# EAGLE design MySens-GWeasyRS485-Nano-005 (EAGLE 7.3.0)
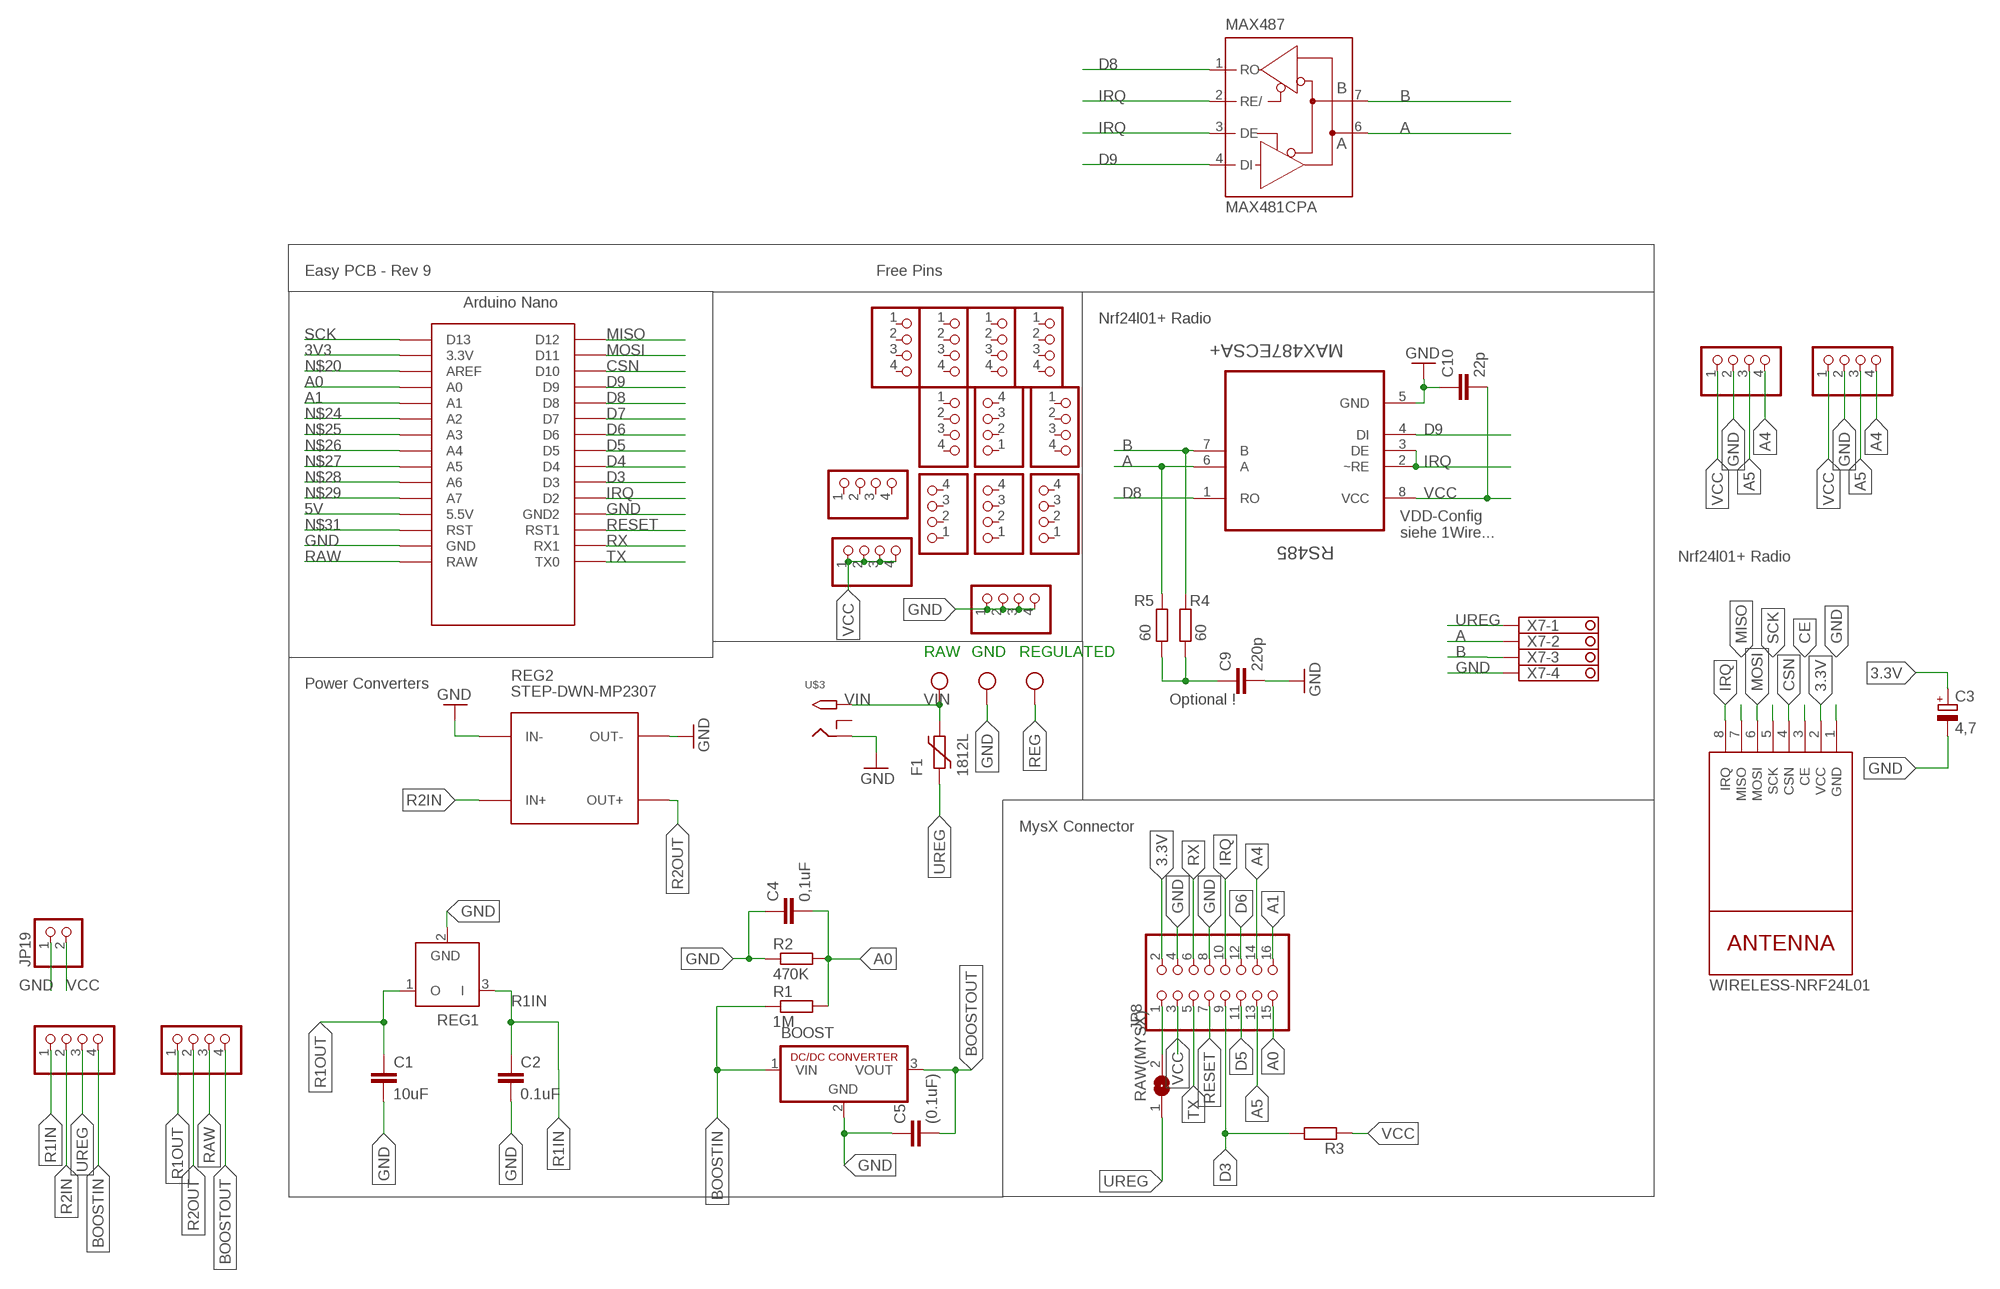
[diagram p0: schematic, sheet 1]

## Parts
BOOST  R-78C1.8-1.0  [SIP3]
C1  10uF  C-EUC1210  [C1210]
C2  0.1uF  C-EUC1206  [C1206]
C3  4,7  CPOL-EUSMCC  [SMC_C]
C4  0,1uF  C-EUC1206  [C1206]
C5  (0.1uF)  C-EUC1206  [C1206]
C9  220p  C-EUC0805  [C0805]
C10  22p  C-EUC0805  [C0805]
F1  1812L  [1812L]
JP1  PINHD-1X04_2.54-S  [1X04-S]
JP2  PINHD-1X04_2.54-S  [1X04-S]
JP3  PINHD-1X04_2.54-S  [1X04-S]
JP4  PINHD-1X04_2.54-S  [1X04-S]
JP5  PINHD-1X04_2.54-S  [1X04-S]
JP6  PINHD-1X04_2.54-S  [1X04-S]
JP7  PINHD-1X04_2.54-S  [1X04-S]
JP8  PINHD-2X08_2.54  [2X08]
JP9  PINHD-1X04_2.54-S  [1X04-S]
JP10  PINHD-1X04_2.54-S  [1X04-S]
JP11  PINHD-1X04_2.54-S  [1X04-S]
JP12  PINHD-1X04_2.54-S  [1X04-S]
JP13  PINHD-1X04_2.54-S  [1X04-S]
JP14  PINHD-1X04_2.54-S  [1X04-S]
JP15  PINHD-1X04_2.54-S  [1X04-S]
JP16  PINHD-1X04_2.54-S  [1X04-S]
JP17  PINHD-1X04_2.54-S  [1X04-S]
JP18  PINHD-1X04_2.54-S  [1X04-S]
JP19  PINHD-1X2  [1X02]
MAX487  MAX481CPA  [DIL08]
NRF24L01+  WIRELESS-NRF24L01  [WIRELESS-NRF24L01]
R1  1M  R-EU_R0805  [R0805]
R2  470K  R-EU_R0805  [R0805]
R3  R-EU_R0805  [R0805]
R4  60  R-EU_R0805  [R0805]
R5  60  R-EU_R0805  [R0805]
RAW(MYSX)  SJ  [SJ]
REG1  LP2950Z  [TO92]
REG2  STEP-DWN-MP2307  DC-DC-STEP-DOWN-MP2307  [DC-DC-STEP-DOWN-MP2307]
REGULATED  W237-103  [W237-103]
RS485  MAX487ECSA+  [SOIC127P600X175-8N]
U$2  NANO  [NANO]
U$3  2.1MMJACKTHM  [PJ-102A]
X7  1751264  [1751264]

## Nets
3.3V [Power]: C3.+ JP8.2 NRF24L01+.2(VCC)
3V3: U$2.3.3V
5V: U$2.5V(5.5V)
A: MAX487.6(A) R5.2 RS485.6(A) X7.2
A0: C4.2 JP8.15 R1.2 R2.2 U$2.A0
A1: JP8.16 U$2.A1
A4: JP6.4 JP8.14 JP10.4
A5: JP6.3 JP8.13 JP10.3
B: MAX487.7(B) R4.2 RS485.7(B) X7.3
BOOSTIN [Power]: BOOST.1(VIN) JP2.4 R1.1
BOOSTOUT [Power]: BOOST.3(VOUT) C5.2 JP4.4
CE: NRF24L01+.3(CE)
CSN: NRF24L01+.4(CSN) U$2.D10
D3: JP8.9 R3.2 U$2.D3
D4: U$2.D4
D5: JP8.11 U$2.D5
D6: JP8.12 U$2.D6
D7: U$2.D7
D8: MAX487.1(RO) RS485.1(RO) U$2.D8
D9: MAX487.4(DI) RS485.4(DI) U$2.D9
GND [Power]: BOOST.2(GND) C1.2 C2.2 C3.- C4.1 C5.1 C9.2 C10.1 JP1.1 JP1.2 JP1.3 JP1.4 JP6.2 JP8.4 JP8.8 JP10.2 JP19.1 NRF24L01+.1(GND) R2.1 REG1.2(GND) REG2.IN- REG2.OUT- REGULATED.2 RS485.5(GND) U$2.GND U$2.GND1(GND2) U$3.RING X7.4
IRQ: JP8.10 MAX487.2(RE/) MAX487.3(DE) NRF24L01+.8(IRQ) RS485.2(~RE) RS485.3(DE) U$2.D2
MISO: NRF24L01+.7(MISO) U$2.D12
MOSI: NRF24L01+.6(MOSI) U$2.D11
N$1: JP8.1 RAW(MYSX).2
N$20: U$2.AREF
N$21: C9.1 R4.1 R5.1
N$24: U$2.A2
N$25: U$2.A3
N$26: U$2.A4
N$27: U$2.A5
N$28: U$2.A6
N$29: U$2.A7
N$31: U$2.RST
R1IN [Power]: C2.1 JP2.1 REG1.3(I)
R1OUT [Power]: C1.1 JP4.1 REG1.1(O)
R2IN [Power]: JP2.2 REG2.IN+
R2OUT [Power]: JP4.2 REG2.OUT+
RAW [Power]: JP4.3 U$2.RAW
REG [Power]: REGULATED.1
RESET: JP8.7 U$2.RST1
RX: JP8.6 U$2.RX1
SCK: NRF24L01+.5(SCK) U$2.D13
TX: JP8.5 U$2.TX0
UREG [Power]: F1.P$1 JP2.3 RAW(MYSX).1 X7.1
VCC [Power]: C10.2 JP3.1 JP3.2 JP3.3 JP3.4 JP6.1 JP8.3 JP10.1 JP19.2 R3.1 RS485.8(VCC)
VIN [Power]: F1.P$2 REGULATED.3 U$3.TIP
Unconnected: JP5.1 JP5.2 JP5.3 JP5.4 JP7.1 JP7.2 JP7.3 JP7.4 JP9.1 JP9.2 JP9.3 JP9.4 JP11.1 JP11.2 JP11.3 JP11.4 JP12.1 JP12.2 JP12.3 JP12.4 JP13.1 JP13.2 JP13.3 JP13.4 JP14.1 JP14.2 JP14.3 JP14.4 JP15.1 JP15.2 JP15.3 JP15.4 JP16.1 JP16.2 JP16.3 JP16.4 JP17.1 JP17.2 JP17.3 JP17.4 JP18.1 JP18.2 JP18.3 JP18.4 U$2.ICSP1 U$2.ICSP2 U$2.ICSP3 U$2.ICSP4 U$2.ICSP5 U$2.ICSP6 U$3.RING_SW

## Notes on the sheet
- Easy PCB - Rev 9 | Free Pins
- Nrf24l01+ Radio
- VDD-Config
  siehe 1Wire...
- Nrf24l01+ Radio
- RAW | GND | REGULATED
- Power Converters
- Optional !
- MysX Connector

## Power pins joined to a net without a drawn wire
GND: MAX487.5(GND)
VCC: MAX487.8(VCC)

## Library data of the parts
BOOST = dc-dc-converter:R-78C*-1.0: INNOLINE DC/DC-Converter 1.0 AMP SIP3 Single Output Source: Data sheet <http://www.mikrocontroller.net/attachment/150645/157764-da-01-en-DC_DC_WANDLER_R_78C5_0_1_0.pdf>
C1 C2 C4 C5 C9 C10 = rcl:C-EU: CAPACITOR, European symbol
C3 = rcl:CPOL-EU: POLARIZED CAPACITOR, European symbol
F1 = ptc-littlefuse:1812L
JP1-JP7 JP9-JP18 = pinhead-2:PINHD-1X04: PIN HEADER
JP8 = pinhead-2:PINHD-2X08: PIN HEADER
JP19 = pinhead:PINHD-1X2: PIN HEADER
MAX487 = maxim-4:MAX481CPA: RS485 TRANSEIVER
NRF24L01+ = diy-modules:WIRELESS-NRF24L01: 2.4 GHz Wireless Module based on NRF24L01 chip
R1-R5 = rcl:R-EU_: RESISTOR, European symbol
RAW(MYSX) = jumper:SJ: SMD solder JUMPER
REG1 = linear:LP2950: 100 mA, Low Power Low Dropout Voltage Regulator Source: http://www.onsemi.com/pub/Collateral/LP2950-D.PDF
REG2 = diy-modules:DC-DC-STEP-DOWN-MP2307: DC/DC Step-Down Regulator based on MP2307DN chip MP2307 datasheet available here: https://cdn-shop.adafruit.com/datasheets/MP2307_r1.9.pdf Click here to find device on ebay.com <http://www.ebay.com/sch/dc+dc+3a+mini+converter>
REGULATED = con-wago-500:W237-103: WAGO SCREW CLAMP; MPN: 237-103; OC_FARNELL: unknown; OC_NEWARK: 18M7116
RS485 = Maxim_By_element14_Batch_1:MAX487ECSA+: Low-Power, Slew-Rate-Limited RS-485/RS-422 Transceivers; MPN: MAX487ECSA+; OC_FARNELL: 9724532; OC_NEWARK: 68K4803; PACKAGE: SOIC-8; SUPPLIER: Maxim
U$2 = Arduino-clone:NANO: Arduino Nano
U$3 = adafruit:2.1MMJACK: 2.1mm x 5.5mm THM DC jack with internal switch. Digikey part #PJ-102A, 4UCON part #05537 2.1mm x 5.5mm SMT DC jack with internal switch. Digikey part #PJ-002A-SMT, 4UCON part #03267 By microbuilder.eu & adafruit.com
X7 = con-phoenix-350:1751264: MKDS 1/ 4-3,5 Printklemme Nennstrom: 10 A Bemessungsspannung: 160 V Raster: 3,5 mm Polzahl: 4 Montageart: Löten Anschlussart: Schraubanschluss Anschlussrichtung vom Leiter zur Platine: 0° Source: http://eshop.phoenixcontact.com .. 1751264.pdf; MPN: 1751264; OC_FARNELL: unknown; OC_NEWARK: 10R0934

## Net classes
0 default: width 0.305 mm
1 Power: width 0.508 mm

## Board
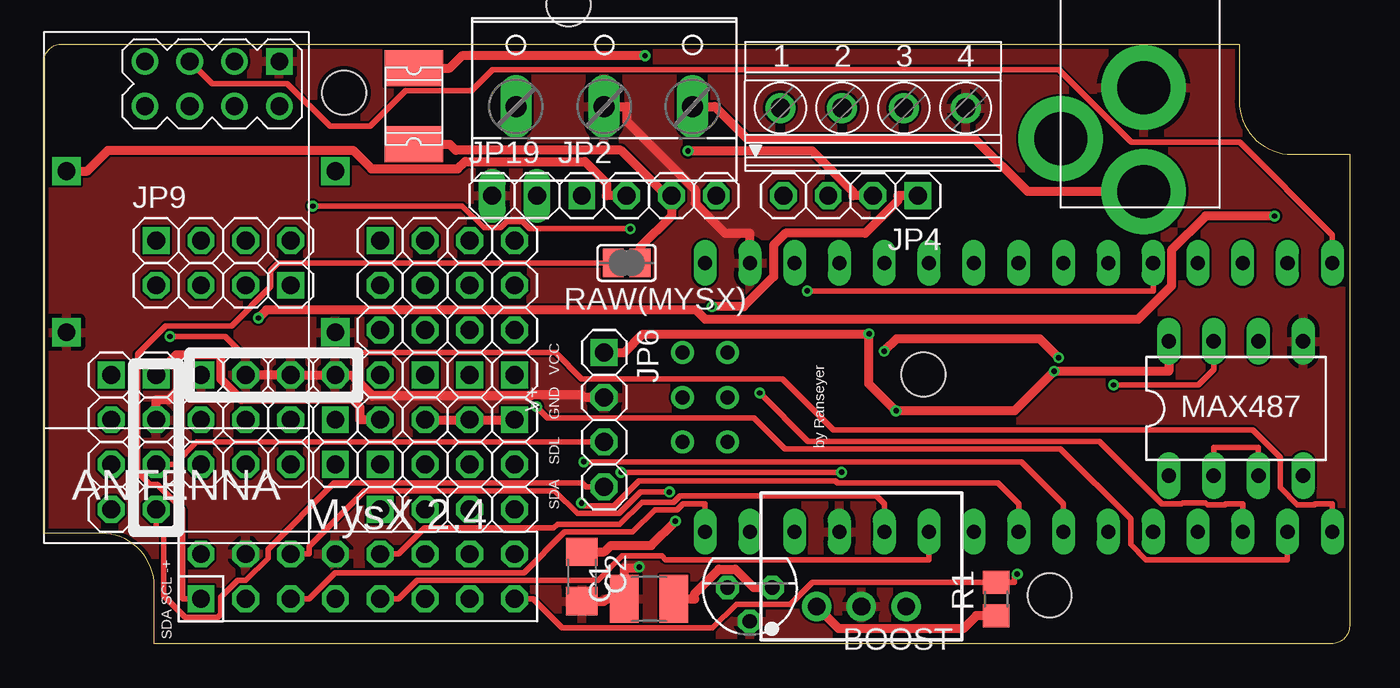
[diagram p1: board, top side]
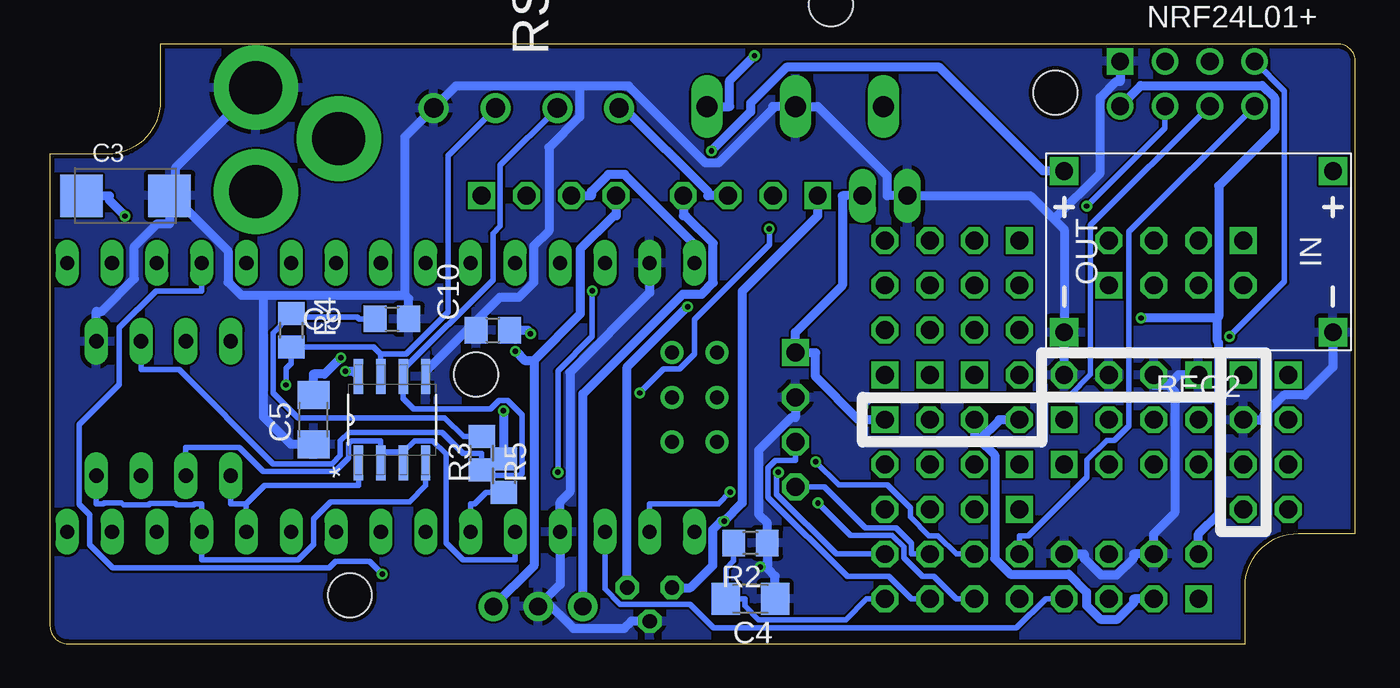
[diagram p2: board, bottom side, seen from below]

Size 74 x 34 mm. Coordinates in mm from the lower left corner, seen from the top.
Outline: 0,6.25 0,33 arc-90 1,34 67.75,34 67.75,30.75 arc90 70.75,27.75 74,27.75 74,1 arc-90 73,0 6.25,0 6.25,3.25 arc90 3.25,6.25 0,6.25
Copper layers (1*16): Top 0.035mm / dielectric 1.5mm / Bottom 0.035mm
Design rules "dirt_cheap_dirty_boards.v1": minimum track width 5mil, minimum drill 12mil, track to track 5mil, track to pad 5mil, pad to pad 5mil, via to via 5mil, smd to smd 0mil, copper to edge 10mil, drill to drill 10mil, minimum pad ring 10mil, minimum via ring 6mil, stop-mask expansion 2mil, vias tented up to drill 25mil, thermal gap 10mil
Holes 2.5 mm at 29.72,36.25 49.85,15.27 57,2.75 17,31.25

### Footprints (pad centres in the part's own frame; a part is rotated, then mirrored left to right if it is on the bottom)
SIP3 = drill 1 pad 1.676: 1 -2.54,0; 2 0,0; 3 2.54,0
C1210 = smd 1.6 x 2.7: 1 -1.4,0; 2 1.4,0
C1206 = smd 1.6 x 1.8: 1 -1.4,0; 2 1.4,0
SMC_C = smd 2.4 x 2.4: + -2.5,0; - 2.5,0
C0805 = smd 1.3 x 1.5: 1 -0.95,0; 2 0.95,0
1812L = smd 2.03 x 3.3: P$1 -2.16,0; P$2 2.16,0
1X04-S = drill 1.016 square: 1 -3.81,0 | drill 1.016 octagon: 2 -1.27,0; 3 1.27,0; 4 3.81,0
2X08 = drill 1.016 square: 1 -8.89,-1.27 | drill 1.016 octagon: 2 -8.89,1.27; 3 -6.35,-1.27; 4 -6.35,1.27; 5 -3.81,-1.27; 6 -3.81,1.27; 7 -1.27,-1.27; 8 -1.27,1.27; 9 1.27,-1.27; 10 1.27,1.27; 11 3.81,-1.27; 12 3.81,1.27; 13 6.35,-1.27; 14 6.35,1.27; 15 8.89,-1.27; 16 8.89,1.27
1X02 = drill 1.016 long: 1 -1.27,0; 2 1.27,0
DIL08 = drill 0.813 long: 1 -3.81,-3.81; 2 -1.27,-3.81; 3 1.27,-3.81; 4 3.81,-3.81; 5 3.81,3.81; 6 1.27,3.81; 7 -1.27,3.81; 8 -3.81,3.81
WIRELESS-NRF24L01 = drill 1 square: 1 -12.7,6.35 | drill 1: 2 -10.16,6.35; 3 -12.7,3.81; 4 -10.16,3.81; 5 -12.7,1.27; 6 -10.16,1.27; 7 -12.7,-1.27; 8 -10.16,-1.27
R0805 = smd 1.3 x 1.5: 1 -0.95,0; 2 0.95,0
SJ = smd 1.168 x 1.6: 1 -0.762,0; 2 0.762,0
TO92 = drill 0.813 octagon: 1 -1.27,0; 2 0,1.905; 3 1.27,0
DC-DC-STEP-DOWN-MP2307 = drill 1 pad 1.6 square: IN+ -7.62,-4.572; IN- -7.62,4.572; OUT+ 7.62,-4.572; OUT- 7.62,4.572
W237-103 = drill 1.194 long: 1 -5,-1.29; 2 0,-1.29; 3 5,-1.29
SOIC127P600X175-8N = smd 1.981 x 0.533: 1 -2.464,1.905; 2 -2.464,0.635; 3 -2.464,-0.635; 4 -2.464,-1.905; 5 2.464,-1.905; 6 2.464,-0.635; 7 2.464,0.635; 8 2.464,1.905
NANO = drill 0.8 long: 3.3V -10.16,24.13; 5V -10.16,-1.27; A0 -10.16,19.05; A1 -10.16,16.51; A2 -10.16,13.97; A3 -10.16,11.43; A4 -10.16,8.89; A5 -10.16,6.35; A6 -10.16,3.81; A7 -10.16,1.27; AREF -10.16,21.59; D2 5.08,1.27; D3 5.08,3.81; D4 5.08,6.35; D5 5.08,8.89; D6 5.08,11.43; D7 5.08,13.97; D8 5.08,16.51; D9 5.08,19.05; D10 5.08,21.59; D11 5.08,24.13; D12 5.08,26.67; D13 -10.16,26.67; GND -10.16,-6.35; GND1 5.08,-1.27; RAW -10.16,-8.89; RST -10.16,-3.81; RST1 5.08,-3.81; RX1 5.08,-6.35; TX0 5.08,-8.89 | drill 0.8: ICSP1 -5.08,-10.16; ICSP2 -5.08,-7.62; ICSP3 -2.54,-10.16; ICSP4 -2.54,-7.62; ICSP5 0,-10.16; ICSP6 0,-7.62
PJ-102A = drill 3 pad 4.8: RING 0.1,-3.39; RING_SW -4.6,-6.29; TIP 0.1,-9.29
1751264 = drill 1.1 pad 1.7: 1 -5.25,-0.1; 2 -1.75,-0.1; 3 1.75,-0.1; 4 5.25,-0.1

### Placement (x,y rotation side)
BOOST  46.33,2.11 0 top
C1  34.29,2.54 180 top
C2  30.48,3.81 270 top
C3  69.72,25.4 0 bottom
C4  34.29,2.54 180 bottom
C5  59.05,12.7 90 bottom
C9  54.61,18.41 0 bottom
C10  48.9,17.78 0 bottom
F1  20.95,30.48 90 top
JP1  12.7,15.24 0 top
JP2  34.29,25.4 0 top
JP3  22.86,12.7 180 top
JP4  45.72,25.4 180 top
JP5  12.7,10.16 180 top
JP6  31.75,12.7 270 top
JP7  24.13,19.05 90 top
JP8  17.78,3.81 0 top
JP9  10.16,22.86 0 top
JP10  6.35,11.43 270 top
JP11  10.16,20.32 180 top
JP12  12.7,12.7 180 top
JP13  26.67,19.05 90 top
JP14  19.05,19.05 270 top
JP15  22.86,10.16 0 top
JP16  3.81,11.43 270 top
JP17  21.59,19.05 90 top
JP18  22.86,7.62 0 top
JP19  26.67,25.4 0 top
MAX487  67.56,13.34 0 top
NRF24L01+  6.99,20.32 270 top
R1  53.98,2.54 90 top
R2  34.29,5.71 180 bottom
R3  48.26,9.53 270 bottom
R4  60.33,17.78 270 bottom
R5  49.53,10.79 270 bottom
RAW(MYSX)  33.02,21.59 180 top
REG1  40.01,3.17 180 top
REG2  8.89,22.23 180 bottom
REGULATED  31.75,31.75 0 top
RS485  54.61,12.7 90 bottom
U$2  46.35,11.43 270 top
U$3  62.23,34.92 0 top
X7  46.99,30.48 0 top

### Tracks (layer width: path | path; a pad name or v marks a point on that pad's centre or on a via)
3.3V  (via drill 0.3 pad 0.61)
  Top 0.508: v69.75,24.25 65.84,24.25 63.91,22.31 63.91,20.29 62.01,18.39 37.48,18.39 36.95,18.93 12.61,18.93 v12.15,18.47
  Bottom 0.508: 7.82,18.47 v12.15,18.47 | NRF24L01+.2 12.16,31.65 5.28,31.65 4.58,30.95 4.58,29.11 7.75,25.95 7.75,18.54 7.82,18.47 | 7.82,18.47 7.82,17.14 7.75,17.06 7.75,7.37 8.89,6.22 JP8.2 | C3.+ 70.64,25.4 70.64,25.14 v69.75,24.25
A
  Bottom 0.305: MAX487.6 68.83,15.54 66.68,15.54 61.34,10.2 58.02,10.2 57.54,10.68 57.54,11.5 57.05,11.99 51.78,11.99 50.57,10.77 49.53,10.77 R5.2 49.23,9.54 47.35,9.54 47.23,9.66 47.23,12.97 48.05,13.79 48.53,13.79 49.02,13.3 53.38,13.3 53.98,13.89 RS485.6 53.98,15.55 48.9,20.63 48.9,23.27 48.48,23.68 48.48,27.14 X7.2
A0  (via drill 0.3 pad 0.61)
  Top 0.305: v55.17,3.95 55.01,3.79 55.01,3.49 R1.2 52.95,3.49 43.56,3.49 42.3,2.23 39.24,2.23 37.9,0.89 29.36,0.89 27.71,2.54 JP8.15
  Bottom 0.305: JP8.15 27.71,2.54 28.89,1.36 33.84,1.36 34.61,2.13 34.61,2.54 C4.2 35.69,4.24 35.24,4.69 R2.2 | v55.17,3.95 55.88,4.66 57.81,4.66 58.16,4.3 70.45,4.3 71.75,5.61 71.75,7.31 72.34,7.9 72.34,12.43 70.06,14.71 70.06,17.93 67.99,20 65.41,20 U$2.A0
A1  (via drill 0.3 pad 0.61)
  Top 0.305: v32.71,9.71 v45.21,9.71 | v43.26,20 62.87,20 U$2.A1
  Bottom 0.305: v43.26,20 43.26,17.41 45.21,15.46 v45.21,9.71 | v32.71,9.71 32.81,9.62 32.81,8.48 29.41,5.08 JP8.16
A4
  Top 0.305: JP6.4 30.71,8.89 30.49,9.11 16.45,9.11 12.7,5.35 12.7,4.85 11.43,3.58 10.97,3.58 10.01,2.62 10.01,1.66 9.84,1.5 7.99,1.5 6.78,2.71 6.78,6.15 6.35,6.58 JP10.4
  Bottom 0.305: JP8.14 25.17,5.08 25.17,5.69 26.06,6.58 27.79,6.58 30.1,8.89 30.71,8.89 JP6.4
A5
  Top 0.305: JP10.3 7.39,10.16 8.66,11.43 JP6.3
  Bottom 0.305: JP8.13 25.17,2.54 26.44,3.81 28.8,3.81 33.3,8.3 33.3,9.96 32.86,10.39 31.75,10.39 JP6.3
B  (via drill 0.3 pad 0.61)
  Top 0.305: MAX487.7 66.29,15.54 65.42,14.67 v60.63,14.67
  Bottom 0.305: 55.24,16.43 55.64,16.83 R4.2 60.33,15.9 60.63,15.6 v60.63,14.67 | 55.24,16.43 55.24,16.33 RS485.7 | X7.3 51.44,27.68 51.44,18.8 53.8,16.43 55.24,16.43
BOOSTIN
  Top 0.508: R1.1 52.84,1.59 52.11,0.85 45.05,0.85 BOOST.1
  Bottom 0.508: BOOST.1 43.79,14.16 38.12,19.82 37.05,19.82 36.41,20.47 36.41,22.71 37.96,24.26 38.1,24.26 JP2.4
BOOSTOUT  (via drill 0.3 pad 0.61)
  Top 0.508: v47.62,16.58 48.33,17.29 56.43,17.29 v57.51,16.21
  Bottom 0.508: 46.57,16.07 46.57,4.41 BOOST.3 | 46.57,16.07 43.95,18.7 43.95,22.36 42.05,24.26 41.91,24.26 JP4.4 | v47.62,16.58 47.11,16.07 46.57,16.07 | C5.2 59.05,15.28 58.44,15.28 v57.51,16.21
CSN  (via drill 0.3 pad 0.61)
  Top 0.305: U$2.D10 67.94,7.94 66.99,7.94 66.92,7.87 65.96,7.87 65.84,7.99 64.54,7.99 64.47,7.92 63.37,7.92 59.81,11.48 43.31,11.48 v40.57,14.21 | v15.23,24.81 23.7,24.81 24.93,23.58 25.87,23.58 26.21,23.93 27.13,23.93 27.52,23.53 v33.23,23.53
  Bottom 0.305: v33.23,23.53 33.23,22.63 37.47,18.39 37.47,16.44 38.33,15.58 39.21,15.58 v40.57,14.21 | NRF24L01+.4 10.79,29.24 v15.23,24.81
D3
  Top 0.305: JP8.9 20.09,2.54 21.15,3.6 31.4,3.6 32.77,4.97 35.02,4.97 35.23,4.76 50.16,4.76 U$2.D3
  Bottom 0.305: R3.2 49.29,8.57 49.93,7.94 50.16,7.94 U$2.D3
D5  (via drill 0.3 pad 0.61)
  Top 0.305: v30.47,7.98 30.64,7.81 32.31,7.81 33.73,9.22 44.85,9.22 44.96,9.12 54.07,9.12 55.24,7.94 U$2.D5
  Bottom 0.305: v30.47,7.98 28.64,6.15 26.26,6.15 25.6,5.49 25.6,4.88 24.54,3.81 23.9,3.81 22.63,2.54 JP8.11
D6  (via drill 0.3 pad 0.61)
  Top 0.305: v30.6,10.31 55.41,10.31 57.78,7.94 U$2.D6
  Bottom 0.305: JP8.12 22.63,5.08 23.67,6.12 24.17,6.12 25.22,7.17 25.22,7.7 26.52,8.99 29.28,8.99 v30.6,10.31
D8
  Bottom 0.305: 62.87,7.94 61.84,8.97 56.52,8.97 RS485.1 | MAX487.1 63.75,7.92 63.37,7.92 63.35,7.94 62.87,7.94 | U$2.D8 62.87,7.94
D9
  Bottom 0.305: RS485.4 52.7,8.97 53.62,8.05 58.08,8.05 59.05,7.08 59.05,5.63 59.92,4.76 65.41,4.76 U$2.D9 65.41,7.94 65.79,7.94 65.86,7.87 66.82,7.87 66.89,7.94 68.33,7.94 68.4,7.87 69.83,7.87 69.95,7.99 70.92,7.99 70.98,7.92 71.37,7.92 MAX487.4
GND  (via drill 0.3 pad 0.61)
  Top 0.508: v33.73,4.35 33.65,4.27 32.89,4.27 C4.1 32.3,2.54 31.89,2.54 31.76,2.41 C2.2 | JP6.2 30.61,13.97 30.46,14.12 27.64,14.12 27.56,14.04 18.62,14.04 17.65,15.01 17.65,15.24 JP1.4 JP1.3 JP1.2 | U$2.GND 40.01,23.28 38.6,23.28 36.92,24.96 36.92,25.73 33.03,29.62 33.03,30.46 REGULATED.2 | JP1.1 7.75,15.24 7.75,14.53 7.06,13.84 6.35,13.84 JP10.2
  Bottom 0.508: 33.34,4.35 33.34,4.27 32.89,3.82 32.89,3.18 C4.1 | 33.34,4.35 33.34,4.58 R2.1 33.34,6.85 33.83,7.33 33.83,10.97 31.97,12.83 31.75,12.83 JP6.2 | 33.34,4.35 v33.73,4.35 | 17.09,24.07 16.51,23.48 REG2.OUT- JP1.4 | 17.09,24.07 18.43,25.4 JP19.1 25.6,25.4 26.54,25.4 26.54,26.53 30.47,30.46 REGULATED.2 33.03,30.46 33.03,30.34 36.11,27.26 36.84,27.26 41.2,31.62 43.98,31.62 | 17.09,24.07 14.47,26.69 14.47,30.96 13.55,31.89 13.34,31.89 NRF24L01+.1 | 45.95,2.48 BOOST.2 | 45.95,2.48 45.09,3.35 U$2.GND1 45.09,8.04 44.52,8.6 44.52,15.39 40.01,19.9 U$2.GND | 45.95,2.48 44.33,0.86 41.46,0.86 41.05,1.27 REG1.2 | 66.87,25.24 63.9,22.27 63.9,20.5 63.16,19.76 61.9,19.76 | 67.22,25.24 66.87,25.24 | 66.87,25.24 66.87,27 U$3.RING | 53.88,19.76 53.66,19.55 C9.2 | 61.9,19.76 53.88,19.76 | 53.88,19.76 53.88,28.75 X7.4 51,31.62 43.98,31.62 | 61.9,19.76 61.9,12.87 60.34,11.3 C5.1 | JP8.8 15.37,5.08 15.37,4.83 14.43,3.89 13.53,3.89 12.57,4.84 12.57,5.08 JP8.4 11.43,6.22 10.24,7.41 10.24,14.3 10.61,14.67 | 10.61,14.67 10.03,15.24 JP1.1 | 10.61,14.67 11.43,14.67 JP1.2 | 67.22,25.24 67.22,23.82 67.92,23.82 69.22,22.52 69.22,20.7 71.06,18.85 71.37,18.85 MAX487.5 | C3.- 67.22,25.24 | 50.36,17.78 52.7,15.44 RS485.5 | 43.98,31.62 43.98,29.88 45.72,28.14 45.72,23.41 46.58,22.55 46.58,20.49 47.43,19.64 48.5,19.64 50.36,17.78 | C10.1 50.36,17.78 | JP10.2 5.21,12.7 5.21,12.94 4.05,14.1 2.86,14.1 1.27,15.69 REG2.IN-
  pour Top: 0,34.29 0,0 73.66,0 73.66,34.29
  pour Bottom: 0,34.29 0,0 73.66,0 73.66,34.29
IRQ
  Top 0.305: 36.05,8.37 35.69,8.02 33.88,8.02 32.63,6.76 29.1,6.76 28.89,6.55 21.56,6.55 20.09,5.08 JP8.10 | 36.05,8.37 | 36.05,8.37 47.19,8.37 47.62,7.94 U$2.D2 | MAX487.3 68.83,11.12 66.29,11.12 MAX487.2
  Bottom 0.305: U$2.D2 47.62,4.76 50.59,4.76 51.55,5.72 51.55,10.76 52.3,11.51 53.34,11.51 53.98,10.87 | 55.24,10.87 55.24,11.51 56.9,11.51 57.06,11.34 57.06,10.53 57.83,9.76 61.91,9.76 63.27,11.12 66.29,11.12 MAX487.2 | RS485.2 55.24,10.87 | RS485.3 53.98,10.87 | 53.98,10.87 55.24,10.87 | NRF24L01+.8 12.84,23.35 12.84,12.35 13.66,11.54 14.09,11.54 15.21,10.42 15.21,9.44 18.53,6.12 19.05,6.12 JP8.10
MISO  (via drill 0.3 pad 0.61)
  Top 0.305: U$2.D12 73.03,7.94 72.07,7.94 72,7.87 71.04,7.87 70.06,8.85 70.06,10.56 68.51,12.11 44.76,12.11 41.85,15.02 30.47,15.02 28.99,16.5 11.18,16.5 10.26,17.42 v7.13,17.42
  Bottom 0.305: v7.13,17.42 4.03,20.52 4.03,31.33 NRF24L01+.7
MOSI  (via drill 0.3 pad 0.61)
  Top 0.305: U$2.D11 70.48,4.76 62.46,4.76 61.59,5.63 61.59,7.07 57.62,11.05 42,11.05 40.24,12.81 28.54,12.81 v27.92,13.43
  Bottom 0.305: v27.92,13.43 27.3,14.05 16.22,14.05 15.01,15.25 15.01,23.72 NRF24L01+.6
N$1
  Top 0.305: JP8.1 7.85,2.54 7.85,7.61 6.42,9.04 5.98,9.04 5.3,9.72 5.3,16.43 6.89,18.02 10.63,18.02 12.85,20.24 12.85,21.16 13.28,21.59 RAW(MYSX).2
N$21
  Bottom 0.305: 60.33,18.52 60.46,18.52 61.35,17.62 61.35,14.23 59.93,12.8 51.62,12.8 50.56,11.74 R5.1 | C9.1 56.49,18.41 56.59,18.52 60.33,18.52 | R4.1 60.33,18.52
R1IN  (via drill 0.3 pad 0.61)
  Top 0.508: v35.79,6.95 34.41,5.57 32.12,5.57 31.76,5.21 C2.1
  Bottom 0.508: JP2.1 30.48,24.26 34.76,19.98 34.76,7.97 v35.79,6.95 35.96,6.95 36.43,6.48 36.43,4.44 37.69,3.17 REG1.3
R1OUT  (via drill 0.3 pad 0.61)
  Top 0.508: v37.86,19.11 39.65,19.11 41.35,20.81 41.35,22.59 42.04,23.28 46.55,23.28 48.39,25.11 48.39,25.4 JP4.1 | C1.1 36.87,2.54 36.87,2.83 38.25,4.22 39.19,4.22 40.23,3.17 REG1.1
  Bottom 0.508: REG1.1 41.27,15.69 v37.86,19.11
R2IN
  Top 0.508: JP2.2 31.88,25.4 31.88,26.12 30.66,27.34 23.87,27.34 23.45,26.92 18.56,26.92 17.51,27.98 3.63,27.98 2.45,26.8 REG2.IN+
R2OUT  (via drill 0.3 pad 0.61)
  Top 0.508: v36.5,27.95 43.53,27.95 45.85,25.64 45.85,25.4 JP4.2
  Bottom 0.508: REG2.OUT+ 17.69,26.8 23.57,32.68 32.26,32.68 34.28,30.66 34.28,30.17 v36.5,27.95
RAW
  Bottom 0.508: JP4.3 43.31,25.4 43.31,25.64 42.35,26.6 41.43,26.6 37.47,22.64 U$2.RAW
RESET
  Bottom 0.305: JP8.7 17.55,2.54 19.2,0.89 36.38,0.89 37.73,2.23 41.68,2.23 42.55,3.1 U$2.RST1
RX  (via drill 0.3 pad 0.61)
  Top 0.305: v35.45,8.6 33.8,8.6 32.58,7.38 30.24,7.38 28.95,8.67 18.17,8.67 15.01,5.51 15.01,5.08 JP8.6
  Bottom 0.305: U$2.RX1 40.01,7.94 36.11,7.94 v35.45,8.6
SCK
  Top 0.305: NRF24L01+.5 9.53,31.75 13.79,31.75 16.2,29.34 18.49,29.34 20.5,31.34 24.23,31.34 25.42,32.54 57.52,32.54 61.62,28.43 67.77,28.43 73.03,23.18 U$2.D13
TX
  Top 0.305: JP8.5 15.01,2.54 16.5,4.03 27.19,4.03 29.5,6.33 33.37,6.33 34.62,7.58 35.87,7.58 36.22,7.94 37.47,7.94 U$2.TX0
UREG
  Top 0.508: F1.P$1 22.99,28.32 23.33,27.98 32.69,27.98 35.56,25.11 | 35.56,25.11 35.56,24.83 35.56,24.26 33.82,22.52 33.82,21.59 RAW(MYSX).1 | JP2.3 35.56,25.11
  Bottom 0.508: JP2.3 36.7,25.4 36.7,25.64 41.45,30.38 X7.1
VCC  (via drill 0.3 pad 0.61)
  Top 0.508: 46.74,17.55 v46.76,17.57 | 46.74,17.55 33.93,17.55 32.89,16.51 JP6.1 | 46.74,17.55 46.74,14.75 v48.29,13.2 55.01,13.2 v57.25,15.44 63.75,15.44 MAX487.8 | JP3.4 17.91,12.7 17.91,13.41 17.48,13.84 11.18,13.84 10.03,14.99 10.03,16.21 9.86,16.38 7.49,16.38 JP10.1 | JP3.1 JP3.2 JP3.3
  Bottom 0.508: C10.2 46.91,17.78 46.91,17.72 v46.76,17.57 | R3.1 48.26,13.17 v48.29,13.2 | JP19.2 29.08,25.4 29.08,20.32 31.75,17.65 JP6.1 30.61,16.51 30.61,15.15 28.16,12.7 27.81,12.7 JP3.1 | 21.3,11.56 20.45,10.7 20.45,4.82 19.57,3.94 16.26,3.94 15.24,2.92 15.24,2.17 14.46,1.39 13.49,1.39 12.57,2.3 12.57,2.54 JP8.3 | 21.3,11.56 21.59,11.56 JP3.3 | 21.3,11.56 20.19,12.67 20.19,12.7 JP3.4 | RS485.8 56.79,15.44 v57.25,15.44
VIN  (via drill 0.3 pad 0.61)
  Top 0.508: REGULATED.3 38.03,30.46 39.84,28.64 52.75,28.64 55.76,25.64 U$3.TIP | F1.P$2 22.99,32.64 23.69,33.34 v34.06,33.34
  Bottom 0.508: REGULATED.3 35.47,30.46 35.47,31.93 v34.06,33.34

### Text on the board
tPlace: by Ranseyer | MysX 2.4
tNames: VCC GND RAW | V+ | VCC | GND | SDL | SDA | SDA SCL -+